# Altium project db.PrjPcb
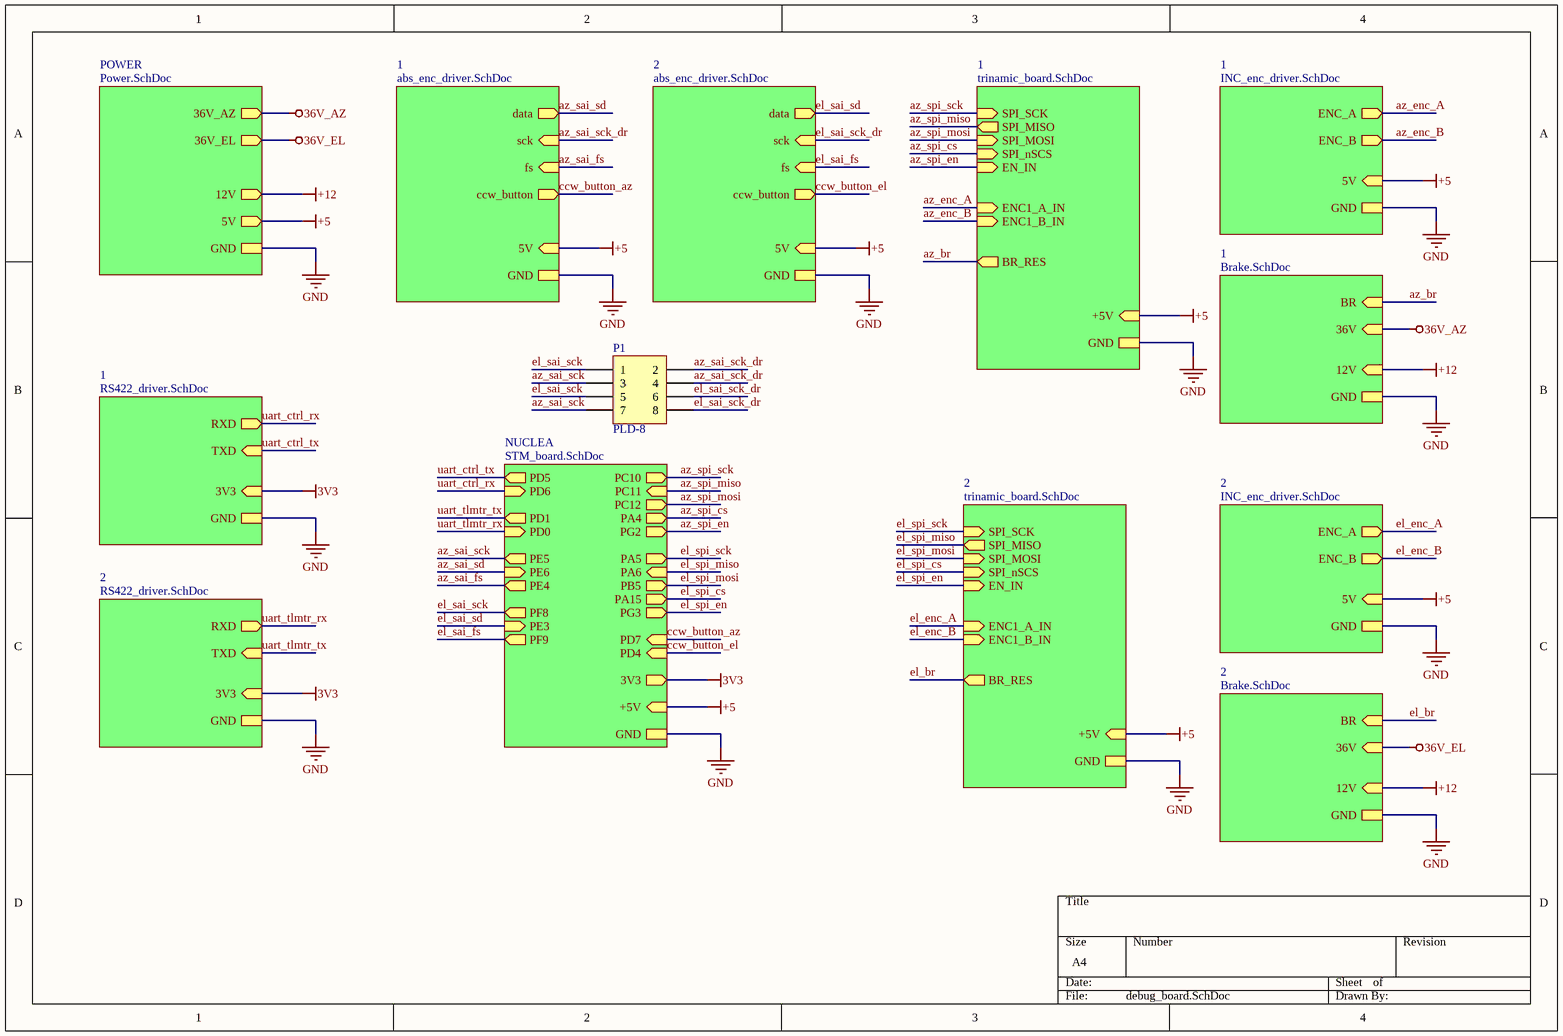
[diagram p0: debug_board.SchDoc]
8 sheets, 209 parts. Net scope: hierarchical (ports join the sheet entries above them; power ports are global).
Board file: DB.PcbDoc
Sheets:
  debug_board.SchDoc
    POWER = Power.SchDoc
    NUCLEA = STM_board.SchDoc
    1 = trinamic_board.SchDoc
    1 = abs_enc_driver.SchDoc
    1 = RS422_driver.SchDoc
    1 = INC_enc_driver.SchDoc
    1 = Brake.SchDoc
    2 = trinamic_board.SchDoc
    2 = INC_enc_driver.SchDoc
    2 = Brake.SchDoc
    2 = abs_enc_driver.SchDoc
    2 = RS422_driver.SchDoc

## Sheet debug_board.SchDoc
size A4; SheetNumber: 1; SheetTotal: 8

### Parts
P1  PLD-8  [PLD-8]

### Sub-sheets
1 = trinamic_board.SchDoc: +5V (in), GND, SPI_SCK (in), SPI_MISO (out), SPI_MOSI (in), SPI_nSCS (in), EN_IN (in), ENC1_A_IN (in), ENC1_B_IN (in), BR_RES (out)
1 = abs_enc_driver.SchDoc: fs (in), 5V (in), GND, data (out), sck (in), ccw_button (out)
1 = RS422_driver.SchDoc: 3V3 (in), GND, RXD (out), TXD (in)
1 = INC_enc_driver.SchDoc: 5V (in), GND, ENC_A (out), ENC_B (out)
1 = Brake.SchDoc: 12V (in), GND, 36V (in), BR (in)
2 = trinamic_board.SchDoc: +5V (in), GND, SPI_SCK (in), SPI_MISO (out), SPI_MOSI (in), SPI_nSCS (in), EN_IN (in), ENC1_A_IN (in), ENC1_B_IN (in), BR_RES (out)
2 = INC_enc_driver.SchDoc: 5V (in), GND, ENC_A (out), ENC_B (out)
2 = Brake.SchDoc: 12V (in), GND, 36V (in), BR (in)
2 = abs_enc_driver.SchDoc: fs (in), 5V (in), GND, data (out), sck (in), ccw_button (out)
2 = RS422_driver.SchDoc: 3V3 (in), GND, RXD (out), TXD (in)
NUCLEA = STM_board.SchDoc: PD5 (out), PD6 (in), PD0 (in), PD1 (out), PE5 (out), PE4 (out), PE6 (in), PF8 (out), PF9 (out), PE3 (in), +5V (in), GND, PC10 (out), PC11 (in), PC12 (out), PA4 (out), PG2 (out), PA5 (out), PA6 (in), PB5 (out), PA15 (out), PG3 (out), PD7 (in), PD4 (in), 3V3 (out)
POWER = Power.SchDoc: 12V (out), 5V (out), GND, 36V_EL (out), 36V_AZ (out)

### Nets
3V3: sheet NUCLEA/3V3, sheet 1/3V3, sheet 2/3V3
36V_AZ: sheet POWER/36V_AZ, sheet 1/36V
36V_EL: sheet POWER/36V_EL, sheet 2/36V
+5: sheet POWER/5V, sheet NUCLEA/+5V, sheet 1/+5V, sheet 1/5V, sheet 1/5V, sheet 2/+5V, sheet 2/5V, sheet 2/5V
+12: sheet POWER/12V, sheet 1/12V, sheet 2/12V
GND: sheet POWER/GND, sheet NUCLEA/GND, sheet 1/GND, sheet 1/GND, sheet 1/GND, sheet 1/GND, sheet 1/GND, sheet 2/GND, sheet 2/GND, sheet 2/GND, sheet 2/GND, sheet 2/GND
az_br: sheet 1/BR_RES, sheet 1/BR
az_enc_A: sheet 1/ENC1_A_IN, sheet 1/ENC_A
az_enc_B: sheet 1/ENC1_B_IN, sheet 1/ENC_B
az_sai_fs: sheet NUCLEA/PE4, sheet 1/fs
az_sai_sck: P1.3 P1.7 ; sheet NUCLEA/PE5
az_sai_sck_dr: P1.2 P1.4 ; sheet 1/sck
az_sai_sd: sheet NUCLEA/PE6, sheet 1/data
az_spi_cs: sheet NUCLEA/PA4, sheet 1/SPI_nSCS
az_spi_en: sheet NUCLEA/PG2, sheet 1/EN_IN
az_spi_miso: sheet NUCLEA/PC11, sheet 1/SPI_MISO
az_spi_mosi: sheet NUCLEA/PC12, sheet 1/SPI_MOSI
az_spi_sck: sheet NUCLEA/PC10, sheet 1/SPI_SCK
ccw_button_az: sheet NUCLEA/PD7, sheet 1/ccw_button
ccw_button_el: sheet NUCLEA/PD4, sheet 2/ccw_button
el_br: sheet 2/BR_RES, sheet 2/BR
el_enc_A: sheet 2/ENC1_A_IN, sheet 2/ENC_A
el_enc_B: sheet 2/ENC1_B_IN, sheet 2/ENC_B
el_sai_fs: sheet NUCLEA/PF9, sheet 2/fs
el_sai_sck: P1.1 P1.5 ; sheet NUCLEA/PF8
el_sai_sck_dr: P1.6 P1.8 ; sheet 2/sck
el_sai_sd: sheet NUCLEA/PE3, sheet 2/data
el_spi_cs: sheet NUCLEA/PA15, sheet 2/SPI_nSCS
el_spi_en: sheet NUCLEA/PG3, sheet 2/EN_IN
el_spi_miso: sheet NUCLEA/PA6, sheet 2/SPI_MISO
el_spi_mosi: sheet NUCLEA/PB5, sheet 2/SPI_MOSI
el_spi_sck: sheet NUCLEA/PA5, sheet 2/SPI_SCK
uart_ctrl_rx: sheet NUCLEA/PD6, sheet 1/RXD  [project net PD6]
uart_ctrl_tx: sheet NUCLEA/PD5, sheet 1/TXD  [project net PD5]
uart_tlmtr_rx: sheet NUCLEA/PD0, sheet 2/RXD  [project net PD0]
uart_tlmtr_tx: sheet NUCLEA/PD1, sheet 2/TXD  [project net PD1]

### Library data of the parts
P1 = PLD-8: Разъем штыревой на плату (папа); Производитель: Connfly electronic (Zhenqin); Номинал: 1А; Напряжение: 300В; Вид монтажа: DIP; Температурный диапазон: -55…140; Примечание: шаг 2.54 мм; Название: PLD-8; Артикул: PLD-8; Тип элемента: Разъем

## Sheet Power.SchDoc
size A4; SheetNumber: 2; SheetTotal: 8
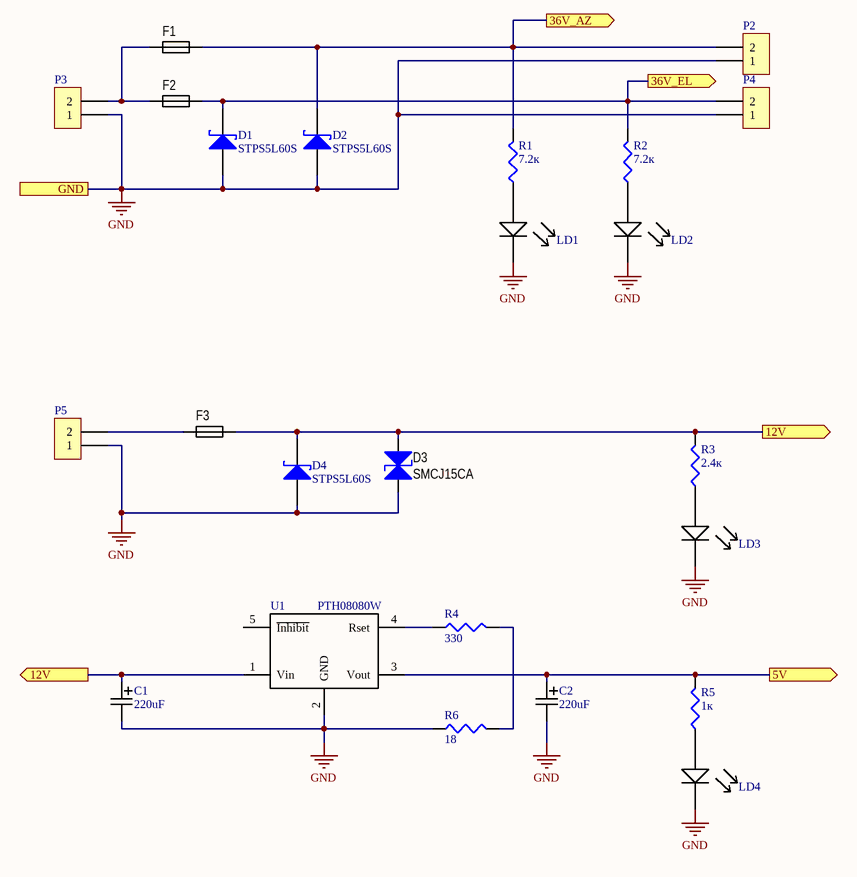
[diagram p1: Power.SchDoc]

### Parts
C1  220uF  [ECAP SMD 8x10.5]
C2  220uF  [ECAP SMD 8x10.5]
D1  STPS5L60S  [SMCJ]
D2  STPS5L60S  [SMCJ]
D3  SMCJ15CA  [SMCJ_CA]
D4  STPS5L60S  [SMCJ]
F1  FH-101C  [FH-101C]  (value not drawn)
F2  FH-101C  [FH-101C]  (value not drawn)
F3  FH-101C  [FH-101C]  (value not drawn)
LD1  GNL-3012ED  [LED 3mm]  (value not drawn)
LD2  GNL-3012ED  [LED 3mm]  (value not drawn)
LD3  GNL-3012ED  [LED 3mm]  (value not drawn)
LD4  GNL-3012ED  [LED 3mm]  (value not drawn)
P2  2EDGR-5.0-02P  [2EDGR-5.0-02P]  (value not drawn)
P3  2EDGR-5.0-02P  [2EDGR-5.0-02P]  (value not drawn)
P4  2EDGR-5.0-02P  [2EDGR-5.0-02P]  (value not drawn)
P5  15EDGRC-3.81-02  [15EDGRC-3.81-02]  (value not drawn)
R1  7.2к  [R1608-0603]
R2  7.2к  [R1608-0603]
R3  2.4к  [R1608-0603]
R4  330  [R1608-0603]
R5  1к  [R1608-0603]
R6  18  [R1608-0603]
U1  PTH08080W  [PTH08080W]

### Ports
5V (out), 12V (out), 36V_AZ (out), 36V_EL (out), GND

### Nets
36V_AZ: D2.1(K) F1.2 P2.2 R1.2 ; port 36V_AZ
36V_EL: D1.1(K) F2.2 P4.2 R2.2 ; port 36V_EL
+5: C2.1 R5.2 U1.3(Vout) ; port 5V
+12: C1.1 D3.2(A) D4.1(K) F3.2 R3.2 U1.1(Vin) ; port 12V
GND: C1.2 C2.2 D1.2(A) D2.2(A) D3.1(K) D4.2(A) LD1.1(K) LD2.1(K) LD3.1(K) LD4.1(K) P2.1 P3.1 P4.1 P5.1 R6.1 U1.2(GND) ; port GND
NetF1_1: F1.1 F2.1 P3.2
NetF3_1: F3.1 P5.2
NetLD1_2: LD1.2(A) R1.1
NetLD2_2: LD2.2(A) R2.1
NetLD3_2: LD3.2(A) R3.1
NetLD4_2: LD4.2(A) R5.1
NetR4_1: R4.1 U1.4(Rset)
NetR4_2: R4.2 R6.2

Not connected (* = marked no-connect by the designer): U1 5(~{Inhibit})

### Library data of the parts
C1 C2 = ECAP SMD: Конденсатор электролитический алюминиевый SMD 8x10.5мм; Производитель: JB Capacitors; Напряжение: 25B; Температурный диапазон: -40 ~ 105; Название: ECAP SMD; Номинал: 220uF; Диэлектрик: Электролит; Вид монтажа: SMD; Тип элемента: Конденсатор электролитический
D1 D2 D4 = STPS5L60S: Диод Шоттки 60В 5А [SMC]; Производитель: STMicroelectronics; Корпус: do-214ab/smc; Вид монтажа: SMD; Название: STPS5L60S; Артикул: STPS5L60S; Напряжение: 60В; Тип элемента: Диод шоттки
D3 = SMCJ_CА: Супрессор двунаправленный; Производитель: ST MICROELECTRONICS CO., LTD.; Корпус: DO-214AB, SMC; Номинал: 15В; Вид монтажа: SMD; Тип элемента: Защитный диод; Температурный диапазон: -55°C ~ 150°C; Название: SMCJ15CA; Артикул: SMCJ15CA; ComponentLink: http://www.digikey.com/product-detail/en/SMBJ5.0CA/SMBJ5.0CABTR-ND/2254207
F1 F2 = FH-101C: Держатель предохранителя 5x20 с крышкой; Производитель: Dragon City Industries; Номинал: 5А; Вид монтажа: DIP; Температурный диапазон: -40…85; Название: FH-101C; Артикул: FH-101C; Корпус: 5x20; Тип элемента: держатель предохранителя
F3 = FH-101C: Держатель предохранителя 5x20 с крышкой; Производитель: Dragon City Industries; Номинал: 0.75А; Вид монтажа: DIP; Температурный диапазон: -40…85; Название: FH-101C; Артикул: FH-101C; Корпус: 5x20; Тип элемента: держатель предохранителя
LD1-LD4 = GNL-3012ED: Светодиод красный 3мм; Производитель: STMicroelectronics; Вид монтажа: DIP; Название: GNL-3012ED; Артикул: GNL-3012ED; Тип элемента: Светодиод
P2-P4 = 2EDGR-5.0-02P: Разъем штыревой на плату (папа); Производитель: Degson; Номинал: 10А; Напряжение: 300В; Вид монтажа: DIP; Температурный диапазон: -40℃~105℃; Примечание: шаг 5 мм; Название: 2EDGR-5.0-02P; Артикул: 2EDGR-5.0-02P; Тип элемента: Разъем
P5 = 15EDGRC-3.81-02: Разъем штыревой на плату (папа); Производитель: Degson; Номинал: 8А; Напряжение: 300В; Вид монтажа: DIP; Температурный диапазон: -40℃~105℃; Примечание: шаг 3.81 мм; Название: 15EDGRC-3.81-02; Артикул: 15EDGRC-3.81-02; Тип элемента: Разъем
R1-R6 = resistor: SMD резистор; Производитель: 1%; Корпус: 0603 (1608 Metric); Точность: 1%; Название: Резистор; Вид монтажа: SMD; Тип элемента: Резистор
  R1 R2: Номинал: 7.2к
  R3: Номинал: 2.4к
  R4: Номинал: 330
  R5: Номинал: 1к
  R6: Номинал: 18
U1 = PTH08080W: DC/DC преобразователь; Производитель: Texas Instruments; Номинал: 2.25А; Напряжение: 18/0.9-5.5В; Вид монтажа: DIP; Тип элемента: Модуль питания; Температурный диапазон: -40°C ~ 85°C; Название: PTH08080W; ComponentLink: http://www.digikey.com/product-detail/en/AD22100STZ/AD22100STZ-ND/936657; Артикул: PTH08080W

## Sheet STM_board.SchDoc
size A4; SheetNumber: 7; SheetTotal: 8
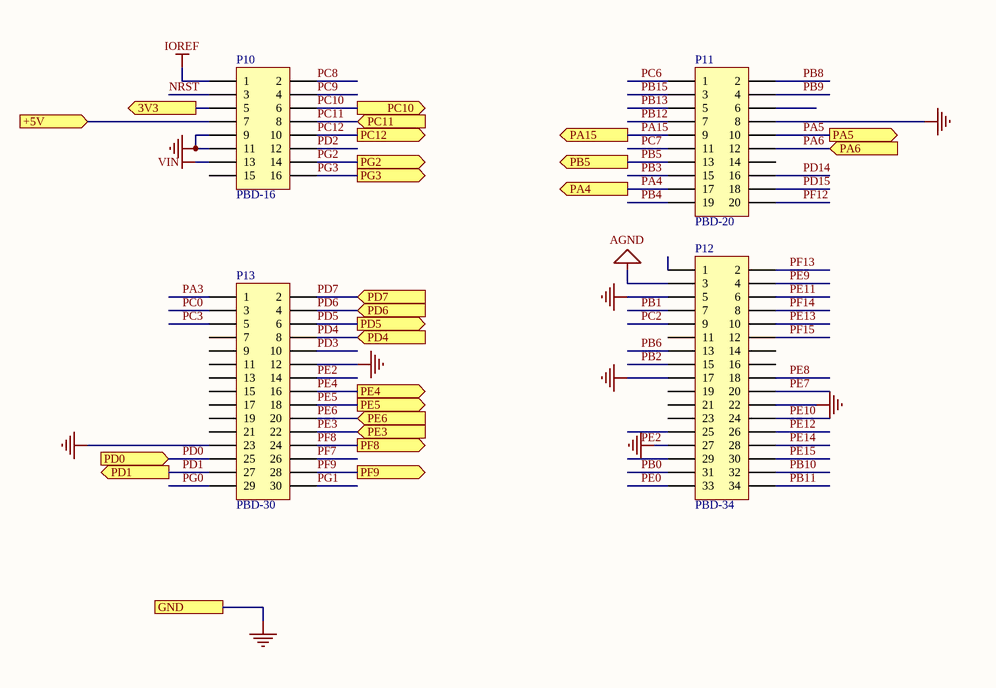
[diagram p2: STM_board.SchDoc]

### Parts
P10  PBD-16  [PBD-16]
P11  PBD-20  [PBD-20]
P12  PBD-34  [PBD-34]
P13  PBD-30  [PBD-30]

### Ports
3V3 (out), +5V (in), GND, PA4 (out), PA5 (out), PA6 (in), PA15 (out), PB5 (out), PC10 (out), PC11 (in), PC12 (out), PD0 (in), PD1 (out), PD4 (in), PD5 (out), PD6 (in), PD7 (in), PE3 (in), PE4 (out), PE5 (out), PE6 (in), PF8 (out), PF9 (out), PG2 (out), PG3 (out)

### Nets
3V3: P10.5 ; port 3V3
+5: P10.7 ; port +5V
AGND: P12.3
GND: P10.9 P10.11 P11.8 P12.5 P12.17 P12.22 P12.27 P13.12 P13.23 ; port GND
IOREF: P10.1
VIN: P10.13
NRST: P10.3
PA3: P13.1
PA4: P11.17 ; port PA4  [project net az_spi_cs]
PA5: P11.10 ; port PA5  [project net el_spi_sck]
PA6: P11.12 ; port PA6  [project net el_spi_miso]
PA15: P11.9 ; port PA15  [project net el_spi_cs]
PB0: P12.31
PB1: P12.7
PB2: P12.15
PB3: P11.15
PB4: P11.19
PB5: P11.13 ; port PB5  [project net el_spi_mosi]
PB6: P12.13
PB8: P11.2
PB9: P11.4
PB10: P12.32
PB11: P12.34
PB12: P11.7
PB13: P11.5
PB15: P11.3
PC0: P13.3
PC2: P12.9
PC3: P13.5
PC6: P11.1
PC7: P11.11
PC8: P10.2
PC9: P10.4
PC10: P10.6 ; port PC10  [project net az_spi_sck]
PC11: P10.8 ; port PC11  [project net az_spi_miso]
PC12: P10.10 ; port PC12  [project net az_spi_mosi]
PD0: P13.25 ; port PD0
PD1: P13.27 ; port PD1
PD2: P10.12
PD3: P13.10
PD4: P13.8 ; port PD4  [project net ccw_button_el]
PD5: P13.6 ; port PD5
PD6: P13.4 ; port PD6
PD7: P13.2 ; port PD7  [project net ccw_button_az]
PD14: P11.16
PD15: P11.18
PE0: P12.33
PE2: P13.14
PE3: P13.22 ; port PE3  [project net el_sai_sd]
PE4: P13.16 ; port PE4  [project net az_sai_fs]
PE5: P13.18 ; port PE5  [project net az_sai_sck]
PE6: P13.20 ; port PE6  [project net az_sai_sd]
PE7: P12.20
PE8: P12.18
PE9: P12.4
PE10: P12.24
PE11: P12.6
PE12: P12.26
PE13: P12.10
PE14: P12.28
PE15: P12.30
PF7: P13.26
PF8: P13.24 ; port PF8  [project net el_sai_sck]
PF9: P13.28 ; port PF9  [project net el_sai_fs]
PF12: P11.20
PF13: P12.2
PF14: P12.8
PF15: P12.12
PG0: P13.29
PG1: P13.30
PG2: P10.14 ; port PG2  [project net az_spi_en]
PG3: P10.16 ; port PG3  [project net el_spi_en]

Not connected (* = marked no-connect by the designer): P10 15; P11 6 14; P12 1 11 14 16 19 21 23 25 29; P13 7 9 11 13 15 17 19 21

### Notes on the sheet
- Labels drawn without touching a wire or pin: PE2

### Library data of the parts
P10 = PBD-16: Гнездо на плату; Производитель: Connfly electronic (Zhenqin); Номинал: 1А; Напряжение: 300В; Вид монтажа: DIP; Тип элемента: Разъем; Температурный диапазон: -55…140; Примечание: шаг 2.54 мм; Название: PBD-16; Артикул: PBD-16
P11 = PBD-20: Гнездо на плату; Производитель: Connfly electronic (Zhenqin); Номинал: 1А; Напряжение: 300В; Вид монтажа: DIP; Тип элемента: Разъем; Температурный диапазон: -55…140; Примечание: шаг 2.54 мм; Название: PBD-20; Артикул: PBD-20
P12 = PBD-34: Гнездо на плату; Производитель: Connfly electronic (Zhenqin); Номинал: 1А; Напряжение: 300В; Вид монтажа: DIP; Тип элемента: Разъем; Температурный диапазон: -55…140; Примечание: шаг 2.54 мм; Название: PBD-34; Артикул: PBD-34
P13 = PBD-30: Гнездо на плату; Производитель: Connfly electronic (Zhenqin); Номинал: 1А; Напряжение: 300В; Вид монтажа: DIP; Тип элемента: Разъем; Температурный диапазон: -55…140; Примечание: шаг 2.54 мм; Название: PBD-30; Артикул: PBD-30

## Sheet trinamic_board.SchDoc
size A4; SheetNumber: 8; SheetTotal: 8
Used 2 times, as channels 1, 2. Parts and nets are listed once, with the designators drawn on the sheet.
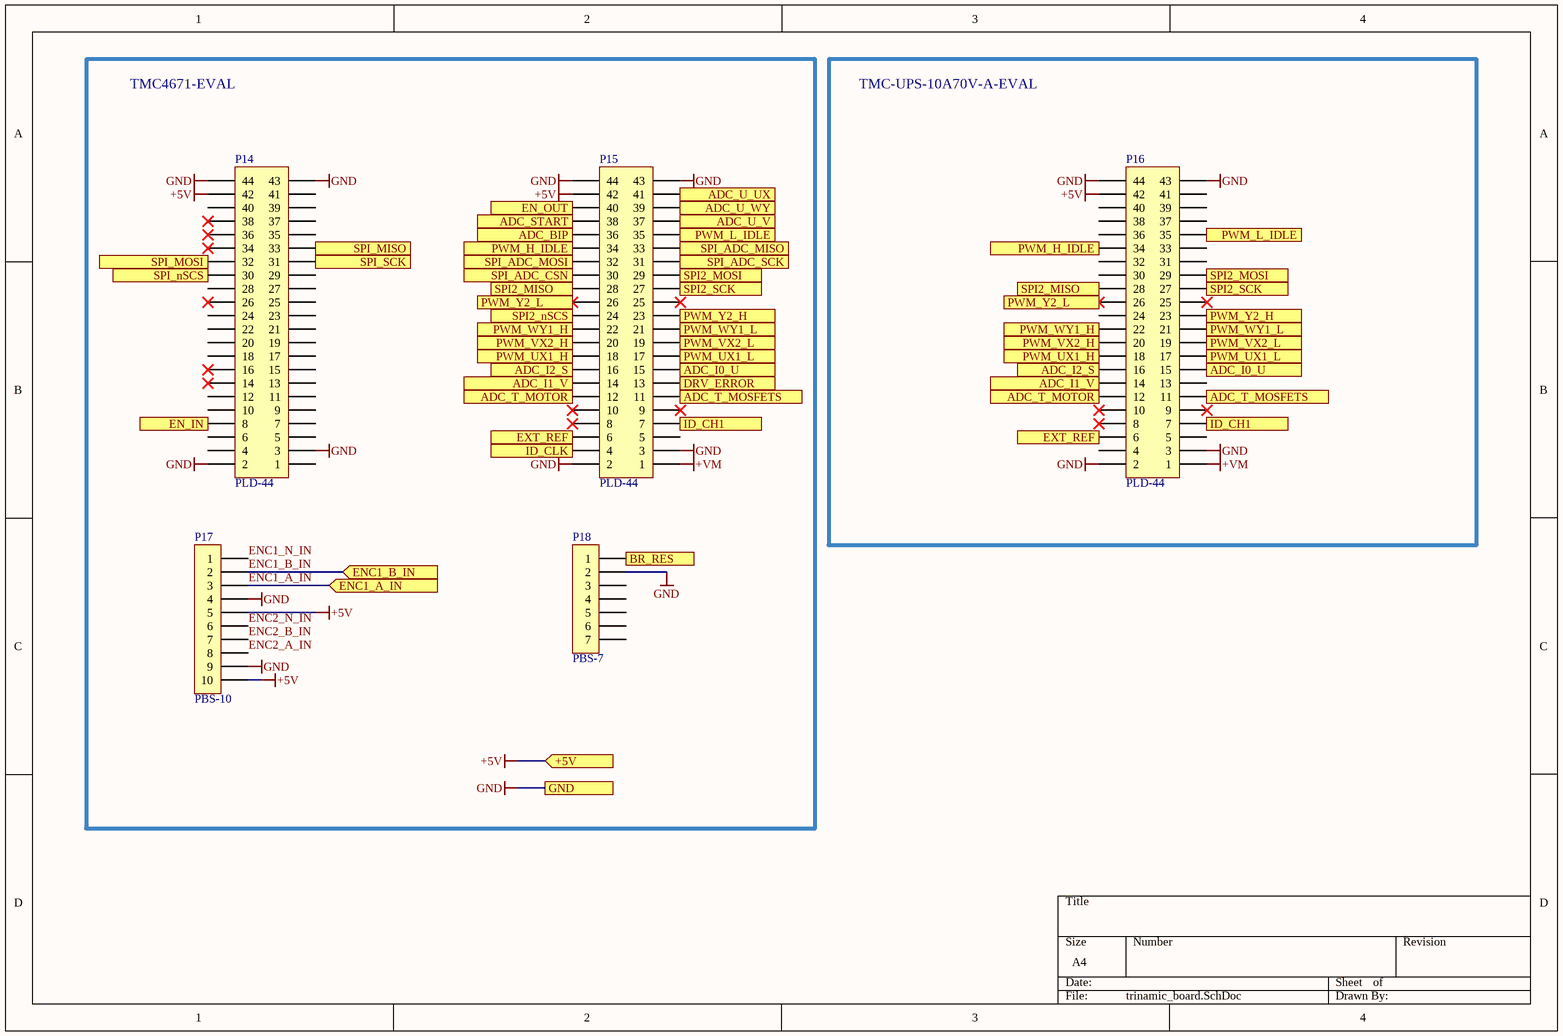
[diagram p3: trinamic_board.SchDoc]

### Parts
P14  PLD-44  [PLD-44]
P15  PLD-44  [PLD-44]
P16  PLD-44  [PLD-44]
P17  PBS-10  [PBS-10]
P18  PBS-7  [PBS-7]

### Blocks framed on the sheet
TMC4671-EVAL: P14 P15 P17 P18
TMC-UPS-10A70V-A-EVAL: P16

### Ports
+5V (in), ADC_BIP, ADC_I0_U, ADC_I1_V, ADC_I2_S, ADC_START, ADC_T_MOSFETS, ADC_T_MOTOR, ADC_U_UX, ADC_U_V, ADC_U_WY, BR_RES (out), DRV_ERROR, EN_IN (in), EN_OUT, ENC1_A_IN (in), ENC1_B_IN (in), EXT_REF, GND, ID_CH1, ID_CLK, PWM_H_IDLE, PWM_L_IDLE, PWM_UX1_H, PWM_UX1_L, PWM_VX2_H, PWM_VX2_L, PWM_WY1_H, PWM_WY1_L, PWM_Y2_H, PWM_Y2_L, SPI2_MISO, SPI2_MOSI, SPI2_nSCS, SPI2_SCK, SPI_ADC_CSN, SPI_ADC_MISO, SPI_ADC_MOSI, SPI_ADC_SCK, SPI_MISO (out), SPI_MOSI (in), SPI_nSCS (in), SPI_SCK (in)

### Nets
+5V: P14.42 P15.42 P16.42 P17.5 P17.10 ; port +5V
+VM: P15.1 P16.1
GND: P14.2 P14.3 P14.43 P14.44 P15.2 P15.3 P15.43 P15.44 P16.2 P16.3 P16.43 P16.44 P17.4 P17.9 P18.2 ; port GND
ADC_BIP: P15.36 ; port ADC_BIP
ADC_I0_U: P15.15 P16.15 ; port ADC_I0_U
ADC_I1_V: P15.14 P16.14 ; port ADC_I1_V
ADC_I2_S: P15.16 P16.16 ; port ADC_I2_S
ADC_START: P15.38 ; port ADC_START
ADC_T_MOSFETS: P15.11 P16.11 ; port ADC_T_MOSFETS
ADC_T_MOTOR: P15.12 P16.12 ; port ADC_T_MOTOR
ADC_U_UX: P15.41 ; port ADC_U_UX
ADC_U_V: P15.37 ; port ADC_U_V
ADC_U_WY: P15.39 ; port ADC_U_WY
BR_RES: P18.1 ; port BR_RES
DRV_ERROR: P15.13 ; port DRV_ERROR
EN_IN: P14.8 ; port EN_IN
EN_OUT: P15.40 ; port EN_OUT
ENC1_A_IN: P17.3 ; port ENC1_A_IN
ENC1_B_IN: P17.2 ; port ENC1_B_IN
ENC1_N_IN: P17.1
ENC2_A_IN: P17.8
ENC2_B_IN: P17.7
ENC2_N_IN: P17.6
EXT_REF: P15.6 P16.6 ; port EXT_REF
ID_CH1: P15.7 P16.7 ; port ID_CH1
ID_CLK: P15.4 ; port ID_CLK
PWM_H_IDLE: P15.34 P16.34 ; port PWM_H_IDLE
PWM_L_IDLE: P15.35 P16.35 ; port PWM_L_IDLE
PWM_UX1_H: P15.18 P16.18 ; port PWM_UX1_H
PWM_UX1_L: P15.17 P16.17 ; port PWM_UX1_L
PWM_VX2_H: P15.20 P16.20 ; port PWM_VX2_H
PWM_VX2_L: P15.19 P16.19 ; port PWM_VX2_L
PWM_WY1_H: P15.22 P16.22 ; port PWM_WY1_H
PWM_WY1_L: P15.21 P16.21 ; port PWM_WY1_L
PWM_Y2_H: P15.23 P16.23 ; port PWM_Y2_H
PWM_Y2_L: P15.26 P16.26 ; port PWM_Y2_L
SPI2_MISO: P15.28 P16.28 ; port SPI2_MISO
SPI2_MOSI: P15.29 P16.29 ; port SPI2_MOSI
SPI2_nSCS: P15.24 ; port SPI2_nSCS
SPI2_SCK: P15.27 P16.27 ; port SPI2_SCK
SPI_ADC_CSN: P15.30 ; port SPI_ADC_CSN
SPI_ADC_MISO: P15.33 ; port SPI_ADC_MISO
SPI_ADC_MOSI: P15.32 ; port SPI_ADC_MOSI
SPI_ADC_SCK: P15.31 ; port SPI_ADC_SCK
SPI_MISO: P14.33 ; port SPI_MISO
SPI_MOSI: P14.32 ; port SPI_MOSI
SPI_nSCS: P14.30 ; port SPI_nSCS
SPI_SCK: P14.31 ; port SPI_SCK

Not connected (* = marked no-connect by the designer): P14 1 4 5 6 7 9 10 11 12 13 14* 15 16* 17 18 19 20 21 22 23 24 25 26* 27 28 29 34* 35 36* 37 38* 39 40 41; P15 5 8* 9* 10* 25*; P16 4 5 8* 9* 10* 13 24 25* 30 31 32 33 36 37 38 39 40 41; P18 3 4 5 6 7

### Channels
1: designators end in _1; ports +5V=+5 ADC_BIP=NetP15_1_36 ADC_I0_U=NetP15_1_15 ADC_I1_V=NetP15_1_14 ADC_I2_S=NetP15_1_16 ADC_START=NetP15_1_38 ADC_T_MOSFETS=NetP15_1_11 ADC_T_MOTOR=NetP15_1_12 ADC_U_UX=NetP15_1_41 ADC_U_V=NetP15_1_37 ADC_U_WY=NetP15_1_39 BR_RES=az_br DRV_ERROR=NetP15_1_13 EN_IN=az_spi_en EN_OUT=NetP15_1_40 ENC1_A_IN=az_enc_A ENC1_B_IN=az_enc_B EXT_REF=NetP15_1_6 GND=GND ID_CH1=NetP15_1_7 ID_CLK=NetP15_1_4 PWM_H_IDLE=NetP15_1_34 PWM_L_IDLE=NetP15_1_35 PWM_UX1_H=NetP15_1_18 PWM_UX1_L=NetP15_1_17 PWM_VX2_H=NetP15_1_20 PWM_VX2_L=NetP15_1_19 PWM_WY1_H=NetP15_1_22 PWM_WY1_L=NetP15_1_21 PWM_Y2_H=NetP15_1_23 PWM_Y2_L=NetP15_1_26 SPI2_MISO=NetP15_1_28 SPI2_MOSI=NetP15_1_29 SPI2_nSCS=NetP15_1_24 SPI2_SCK=NetP15_1_27 SPI_ADC_CSN=NetP15_1_30 SPI_ADC_MISO=NetP15_1_33 SPI_ADC_MOSI=NetP15_1_32 SPI_ADC_SCK=NetP15_1_31 SPI_MISO=az_spi_miso SPI_MOSI=az_spi_mosi SPI_nSCS=az_spi_cs SPI_SCK=az_spi_sck
2: designators end in _2; ports +5V=+5 ADC_BIP=NetP15_2_36 ADC_I0_U=NetP15_2_15 ADC_I1_V=NetP15_2_14 ADC_I2_S=NetP15_2_16 ADC_START=NetP15_2_38 ADC_T_MOSFETS=NetP15_2_11 ADC_T_MOTOR=NetP15_2_12 ADC_U_UX=NetP15_2_41 ADC_U_V=NetP15_2_37 ADC_U_WY=NetP15_2_39 BR_RES=el_br DRV_ERROR=NetP15_2_13 EN_IN=el_spi_en EN_OUT=NetP15_2_40 ENC1_A_IN=el_enc_A ENC1_B_IN=el_enc_B EXT_REF=NetP15_2_6 GND=GND ID_CH1=NetP15_2_7 ID_CLK=NetP15_2_4 PWM_H_IDLE=NetP15_2_34 PWM_L_IDLE=NetP15_2_35 PWM_UX1_H=NetP15_2_18 PWM_UX1_L=NetP15_2_17 PWM_VX2_H=NetP15_2_20 PWM_VX2_L=NetP15_2_19 PWM_WY1_H=NetP15_2_22 PWM_WY1_L=NetP15_2_21 PWM_Y2_H=NetP15_2_23 PWM_Y2_L=NetP15_2_26 SPI2_MISO=NetP15_2_28 SPI2_MOSI=NetP15_2_29 SPI2_nSCS=NetP15_2_24 SPI2_SCK=NetP15_2_27 SPI_ADC_CSN=NetP15_2_30 SPI_ADC_MISO=NetP15_2_33 SPI_ADC_MOSI=NetP15_2_32 SPI_ADC_SCK=NetP15_2_31 SPI_MISO=el_spi_miso SPI_MOSI=el_spi_mosi SPI_nSCS=el_spi_cs SPI_SCK=el_spi_sck

### Library data of the parts
P14-P16 = PLD-44: Разъем штыревой на плату (папа); Производитель: Connfly electronic (Zhenqin); Номинал: 1А; Напряжение: 300В; Вид монтажа: DIP; Температурный диапазон: -55…140; Примечание: шаг 2.54 мм; Название: PLD-44; Артикул: PLD-44; Тип элемента: Разъем
P17 = PBS-10: Гнездо на плату; Производитель: Connfly electronic (Zhenqin); Номинал: 1А; Напряжение: 300В; Вид монтажа: DIP; Тип элемента: Разъем; Температурный диапазон: -55…140; Примечание: шаг 2.54 мм; Название: PBS-10; Артикул: PBS-10
P18 = PBS-7: Гнездо на плату; Производитель: Connfly electronic (Zhenqin); Номинал: 1А; Напряжение: 300В; Вид монтажа: DIP; Тип элемента: Разъем; Температурный диапазон: -55…140; Примечание: шаг 2.54 мм; Название: PBS-7; Артикул: PBS-7

## Sheet abs_enc_driver.SchDoc
size A4; SheetNumber: 3; SheetTotal: 8
Used 2 times, as channels 1, 2. Parts and nets are listed once, with the designators drawn on the sheet.
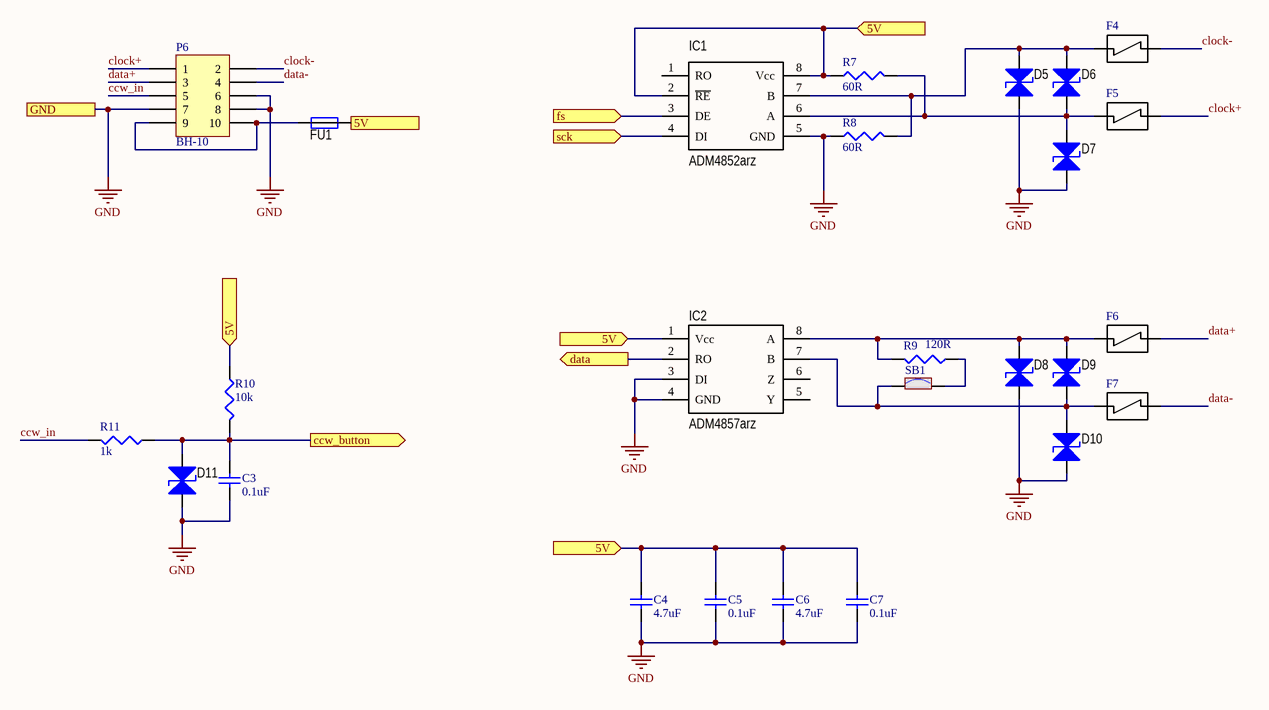
[diagram p4: abs_enc_driver.SchDoc]

### Parts
C3  0.1uF  [C1608-0603]
C4  4.7uF  [C1608-0603]
C5  0.1uF  [C1608-0603]
C6  4.7uF  [C1608-0603]
C7  0.1uF  [C1608-0603]
D5  SMBJ5.0CA  [SMB_H]  (value not drawn)
D6  SMBJ5.0CA  [SMB_H]  (value not drawn)
D7  SMBJ5.0CA  [SMB_H]  (value not drawn)
D8  SMBJ5.0CA  [SMB_H]  (value not drawn)
D9  SMBJ5.0CA  [SMB_H]  (value not drawn)
D10  SMBJ5.0CA  [SMB_H]  (value not drawn)
D11  SMBJ5.0CA  [SMB_H]  (value not drawn)
F4  TBU-CA065-200-WH  [TBU_CA]  (value not drawn)
F5  TBU-CA065-200-WH  [TBU_CA]  (value not drawn)
F6  TBU-CA065-200-WH  [TBU_CA]  (value not drawn)
F7  TBU-CA065-200-WH  [TBU_CA]  (value not drawn)
FU1  MF-MSMF030  [MF-MSMF]  (value not drawn)
IC1  ADM4852arz  [SO8_N]
IC2  ADM4857arz  [SO8_N]
P6  BH-10  [BH-10]
R7  60R  [R1608-0603]
R8  60R  [R1608-0603]
R9  120R  [R1608-0603]
R10  10k  [R1608-0603]
R11  1k  [R1608-0603]
SB1  (no value)  [SOLDER-BRIDGE_R0603-0R]  (no BOM)

### Ports
5V (in), ccw_button (out), data (out), fs (in), GND, sck (in)

### Nets
GND: C3.1 C4.1 C5.1 C6.1 C7.1 D5.1(K) D7.1(K) D8.1(K) D10.1(K) D11.1(K) IC1.5(GND) IC2.3(DI) IC2.4(GND) P6.6 P6.7 P6.8 R8.1 ; port GND
5V: C4.2 C5.2 C6.2 C7.2 FU1.2 IC1.2(~{RE}) IC1.8(Vcc) IC2.1(Vcc) R7.1 R10.1 ; port 5V
ccw_button: C3.2 D11.2(A) R10.2 R11.1 ; port ccw_button
ccw_in: P6.5 R11.2
clock+: F5.1 P6.1
clock-: F4.1 P6.2
data: IC2.2(RO) ; port data
data+: F6.1 P6.3
data-: F7.1 P6.4
fs: IC1.3(DE) ; port fs
sck: IC1.4(DI) ; port sck
NetD5_2: D5.2(A) D6.2(A) F4.0 IC1.7(B) R8.2
NetD6_1: D6.1(K) D7.2(A) F5.0 IC1.6(A) R7.2
NetD8_2: D8.2(A) D9.2(A) F6.0 IC2.8(A) R9.2
NetD9_1: D9.1(K) D10.2(A) F7.0 IC2.7(B) SB1.1
NetFU1_1: FU1.1 P6.9 P6.10
NetR9_1: R9.1 SB1.2

Not connected (* = marked no-connect by the designer): IC1 1(RO); IC2 5(Y) 6(Z)

### Channels
1: designators end in _1; ports 5V=+5 ccw_button=ccw_button_az data=az_sai_sd fs=az_sai_fs GND=GND sck=az_sai_sck_dr
2: designators end in _2; ports 5V=+5 ccw_button=ccw_button_el data=el_sai_sd fs=el_sai_fs GND=GND sck=el_sai_sck_dr

### Library data of the parts
C3-C7 = Cap: Керамическийконденсатор; Корпус: 0603 (1608 Metric); Диэлектрик: X5R; Напряжение: 16B; Вид монтажа: SMD; Температурный диапазон: -55 ~ 100; Тип элемента: Керамический конденсатор
  C3 C5 C7: Номинал: 0.1uF
  C4 C6: Номинал: 4.7uF
D5-D11 = SMBJ_CА: Супрессор двунаправленный; Производитель: ST MICROELECTRONICS CO., LTD.; Корпус: DO-214AA, SMB; Номинал: 5В; Вид монтажа: SMD; Тип элемента: Защитный диод; Температурный диапазон: -55°C ~ 150°C; Название: SMBJ5.0CA; Артикул: SMBJ5.0CA; ComponentLink: http://www.digikey.com/product-detail/en/SMBJ5.0CA/SMBJ5.0CABTR-ND/2254207
F4-F7 = TBU-CA: Самовосстанавливающийся предохранитель; Производитель: Bourns; Корпус: DFN; Номинал: 0.4A; Вид монтажа: SMD; Температурный диапазон: -40 to +125 °C; Название: TBU-CA065-200-WH; Артикул: TBU-CA065-200-WH; Тип элемента: Самовосстанавливающийся предохранитель
FU1 = MF-MSMF030: PTC Resettable Fuses; Производитель: Bourns; Корпус: 1812; Номинал: 0.3А; Вид монтажа: SMD; Тип элемента: Самовосстанавливающийся предохранитель; Температурный диапазон: -40…85; Напряжение: 13.2В; Название: MF-MSMF030; Артикул: MF-MSMF030
IC1 = ADM4852: RS-485 Трансивер; Производитель: Analog Devices; Корпус: SOIC8; Вид монтажа: SMD; Тип элемента: Драйвер интерфейса RS-485; Температурный диапазон: -40°C ~ 85°C; Артикул: ADM4852arz; Название: ADM4852arz
IC2 = ADM4857: RS-485 Трансивер; Производитель: Analog Devices; Корпус: SOIC8; Вид монтажа: SMD; Тип элемента: Драйвер интерфейса RS-485; Температурный диапазон: -40°C ~ 85°C; Артикул: ADM4857arz; Название: ADM4857arz
P6 = BH-10: Разъем штыревой на плату; Производитель: Connfly electronic (Zhenqin); Номинал: 1А; Напряжение: 300В; Вид монтажа: DIP; Температурный диапазон: -55…140; Примечание: шаг 2.54 мм; Название: BH-10; Артикул: BH-10; Тип элемента: Разъем
R7-R11 = resistor: as R1 on sheet Power; Точность: 1%; Название: Резистор; Вид монтажа: SMD; Тип элемента: Резистор
  R7 R8: Номинал: 60R
  R9: Номинал: 120R
  R10: Номинал: 10k
  R11: Номинал: 1k
SB1 = SB: Перемычка

## Sheet RS422_driver.SchDoc
size A4; SheetNumber: 4; SheetTotal: 8
Used 2 times, as channels 1, 2. Parts and nets are listed once, with the designators drawn on the sheet.
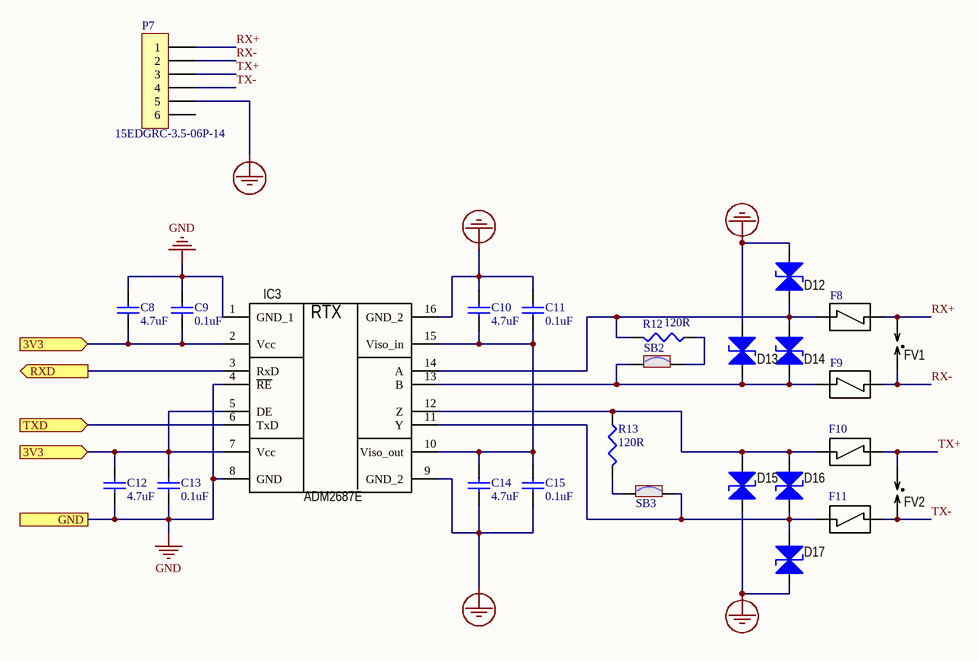
[diagram p5: RS422_driver.SchDoc]

### Parts
C8  4.7uF  [C1608-0603]
C9  0.1uF  [C1608-0603]
C10  4.7uF  [C1608-0603]
C11  0.1uF  [C1608-0603]
C12  4.7uF  [C1608-0603]
C13  0.1uF  [C1608-0603]
C14  4.7uF  [C1608-0603]
C15  0.1uF  [C1608-0603]
D12  SMBJ5.0CA  [SMB_H]  (value not drawn)
D13  SMBJ5.0CA  [SMB_H]  (value not drawn)
D14  SMBJ5.0CA  [SMB_H]  (value not drawn)
D15  SMBJ5.0CA  [SMB_H]  (value not drawn)
D16  SMBJ5.0CA  [SMB_H]  (value not drawn)
D17  SMBJ5.0CA  [SMB_H]  (value not drawn)
F8  TBU-CA065-200-WH  [TBU_CA]  (value not drawn)
F9  TBU-CA065-200-WH  [TBU_CA]  (value not drawn)
F10  TBU-CA065-200-WH  [TBU_CA]  (value not drawn)
F11  TBU-CA065-200-WH  [TBU_CA]  (value not drawn)
FV1  NS2R-75A1-M  [NS2R-xxx-x]  (value not drawn)
FV2  NS2R-75A1-M  [NS2R-xxx-x]  (value not drawn)
IC3  ADM2687E  [SO16_WIDE(300mil)_13x10_H]
P7  15EDGRC-3.5-06P-14  [15EDGRC-3.5-06P-14]
R12  120R  [R1608-0603]
R13  120R  [R1608-0603]
SB2  (no value)  [SOLDER-BRIDGE_R0603-0R]  (no BOM)
SB3  (no value)  [SOLDER-BRIDGE_R0603-0R]  (no BOM)

### Ports
3V3 (in), GND, RXD (out), TXD (in)

### Nets
GND: C8.2 C9.2 C12.1 C13.1 IC3.1(GND_1) IC3.4(~{RE}) IC3.8(GND) ; port GND
GND_line: C10.2 C11.2 C14.1 C15.1 D12.1(K) D13.1(K) D15.1(K) D17.1(K) IC3.9(GND_2) IC3.16(GND_2) P7.5
3V3: C8.1 C9.1 C12.2 C13.2 IC3.2(Vcc) IC3.5(DE) IC3.7(Vcc) ; port 3V3
RX+: F8.1 FV1.2(L) P7.1
RX-: F9.1 FV1.1(R) P7.2
RXD: IC3.3(RxD) ; port RXD
TX+: F10.1 FV2.1(R) P7.3
TX-: F11.1 FV2.2(L) P7.4
TXD: IC3.6(TxD) ; port TXD
NetC10_1: C10.1 C11.1 C14.2 C15.2 IC3.10(Viso_out) IC3.15(Viso_in)
NetD12_2: D12.2(A) D14.1(K) F8.0 IC3.14(A) R12.2
NetD13_2: D13.2(A) D14.2(A) F9.0 IC3.13(B) SB2.1
NetD15_2: D15.2(A) D16.2(A) F10.0 IC3.12(Z) R13.2
NetD16_1: D16.1(K) D17.2(A) F11.0 IC3.11(Y) SB3.1
NetR12_1: R12.1 SB2.2
NetR13_1: R13.1 SB3.2

Not connected (* = marked no-connect by the designer): P7 6

### Channels
1: designators end in _1; ports 3V3=3V3 GND=GND RXD=PD6 TXD=PD5
2: designators end in _2; ports 3V3=3V3 GND=GND RXD=PD0 TXD=PD1

### Notes on the sheet
- (in symbol ADM2687E) RTX

### Library data of the parts
C8-C15 = Cap: as C3 on sheet abs_enc_driver; Тип элемента: Керамический конденсатор
  C8 C10 C12 C14: Номинал: 4.7uF
  C9 C11 C13 C15: Номинал: 0.1uF
D12-D17 = SMBJ_CА: as D5 on sheet abs_enc_driver; Название: SMBJ5.0CA; Артикул: SMBJ5.0CA; ComponentLink: http://www.digikey.com/product-detail/en/SMBJ5.0CA/SMBJ5.0CABTR-ND/2254207
F8-F11 = TBU-CA: as F4 on sheet abs_enc_driver; Название: TBU-CA065-200-WH; Артикул: TBU-CA065-200-WH; Тип элемента: Самовосстанавливающийся предохранитель
FV1 FV2 = NS2R-xxx-x_1: Газовый разрядник двухэлектродный; Номинал: 75В; Название: NS2R-75A1-M; Артикул: NS2R-75A1-M; Напряжение: 75В; Тип элемента: разрядник двухэлектродный
IC3 = ADM2687E: RS-485 Трансивер изолированный; Производитель: Analog Devices; Корпус: SOIC16; Вид монтажа: SMD; Тип элемента: Драйвер интерфейса RS-485, RS-422; Температурный диапазон: -40°C ~ 85°C; Артикул: ADM2687E; Название: ADM2687E
P7 = 15EDGRC-3.5-06P-14: Разъем штыревой на плату (папа); Производитель: Degson; Номинал: 8А; Напряжение: 300В; Вид монтажа: DIP; Температурный диапазон: -40℃~105℃; Примечание: шаг 3.5 мм; Название: 15EDGRC-3.5-06P-14; Артикул: 15EDGRC-3.5-06P-14; Тип элемента: Разъем
R12 R13 = resistor: as R1 on sheet Power; Номинал: 120R; Точность: 1%; Название: Резистор; Вид монтажа: SMD; Тип элемента: Резистор
SB2 SB3 = SB: Перемычка

## Sheet INC_enc_driver.SchDoc
size A4; SheetNumber: 5; SheetTotal: 8
Used 2 times, as channels 1, 2. Parts and nets are listed once, with the designators drawn on the sheet.
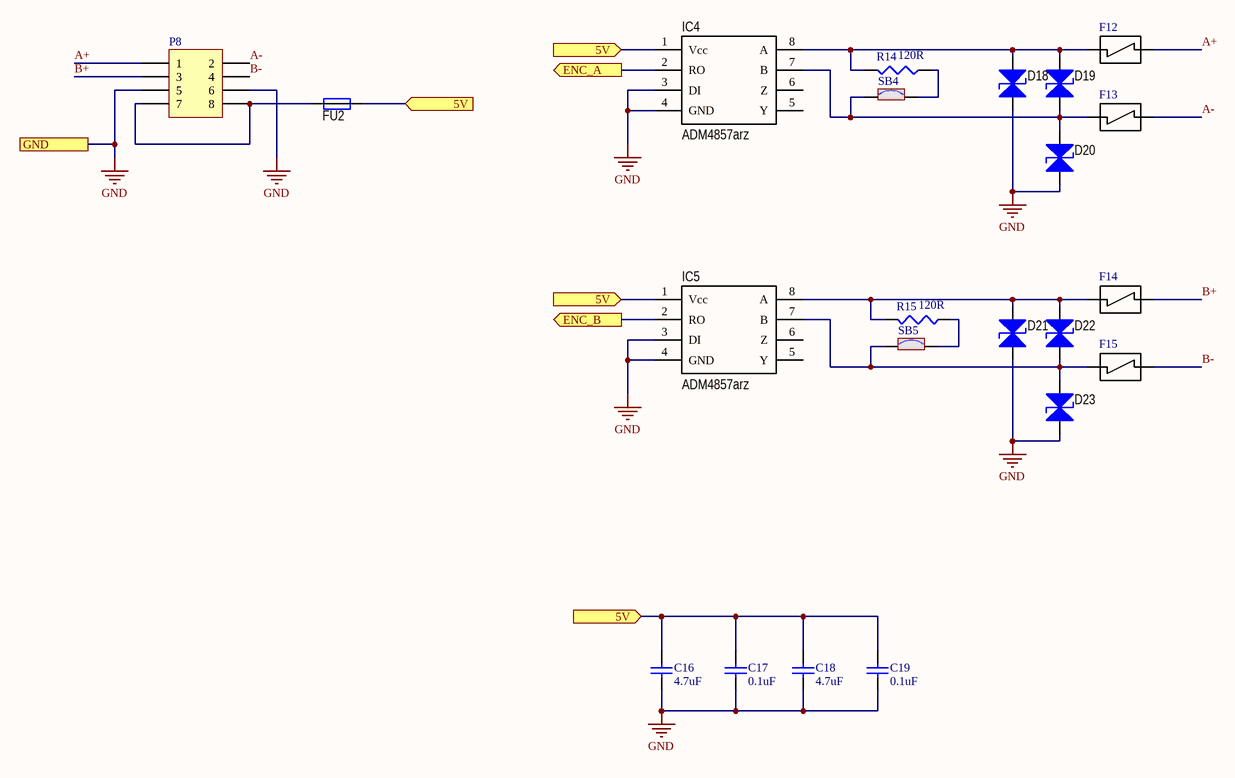
[diagram p6: INC_enc_driver.SchDoc]

### Parts
C16  4.7uF  [C1608-0603]
C17  0.1uF  [C1608-0603]
C18  4.7uF  [C1608-0603]
C19  0.1uF  [C1608-0603]
D18  SMBJ5.0CA  [SMB_H]  (value not drawn)
D19  SMBJ5.0CA  [SMB_H]  (value not drawn)
D20  SMBJ5.0CA  [SMB_H]  (value not drawn)
D21  SMBJ5.0CA  [SMB_H]  (value not drawn)
D22  SMBJ5.0CA  [SMB_H]  (value not drawn)
D23  SMBJ5.0CA  [SMB_H]  (value not drawn)
F12  TBU-CA065-200-WH  [TBU_CA]  (value not drawn)
F13  TBU-CA065-200-WH  [TBU_CA]  (value not drawn)
F14  TBU-CA065-200-WH  [TBU_CA]  (value not drawn)
F15  TBU-CA065-200-WH  [TBU_CA]  (value not drawn)
FU2  MF-MSMF030  [MF-MSMF]  (value not drawn)
IC4  ADM4857arz  [SO8_N]
IC5  ADM4857arz  [SO8_N]
P8  BH-08  [BH-08]  (value not drawn)
R14  120R  [R1608-0603]
R15  120R  [R1608-0603]
SB4  (no value)  [SOLDER-BRIDGE_R0603-0R]  (no BOM)
SB5  (no value)  [SOLDER-BRIDGE_R0603-0R]  (no BOM)

### Ports
5V (in), ENC_A (out), ENC_B (out), GND

### Nets
GND: C16.1 C17.1 C18.1 C19.1 D18.1(K) D20.1(K) D21.1(K) D23.1(K) IC4.3(DI) IC4.4(GND) IC5.3(DI) IC5.4(GND) P8.5 P8.6 ; port GND
5V: C16.2 C17.2 C18.2 C19.2 FU2.2 IC4.1(Vcc) IC5.1(Vcc) ; port 5V
A+: F12.1 P8.1
A-: F13.1 P8.2
B+: F14.1 P8.3
B-: F15.1 P8.4
ENC_A: IC4.2(RO) ; port ENC_A
ENC_B: IC5.2(RO) ; port ENC_B
NetD18_2: D18.2(A) D19.2(A) F12.0 IC4.8(A) R14.2
NetD19_1: D19.1(K) D20.2(A) F13.0 IC4.7(B) SB4.1
NetD21_2: D21.2(A) D22.2(A) F14.0 IC5.8(A) R15.2
NetD22_1: D22.1(K) D23.2(A) F15.0 IC5.7(B) SB5.1
NetFU2_1: FU2.1 P8.7 P8.8
NetR14_1: R14.1 SB4.2
NetR15_1: R15.1 SB5.2

Not connected (* = marked no-connect by the designer): IC4 5(Y) 6(Z); IC5 5(Y) 6(Z)

### Channels
1: designators end in _1; ports 5V=+5 ENC_A=az_enc_A ENC_B=az_enc_B GND=GND
2: designators end in _2; ports 5V=+5 ENC_A=el_enc_A ENC_B=el_enc_B GND=GND

### Library data of the parts
C16-C19 = Cap: as C3 on sheet abs_enc_driver; Тип элемента: Керамический конденсатор
  C16 C18: Номинал: 4.7uF
  C17 C19: Номинал: 0.1uF
D18-D23 = SMBJ_CА: as D5 on sheet abs_enc_driver; Название: SMBJ5.0CA; Артикул: SMBJ5.0CA; ComponentLink: http://www.digikey.com/product-detail/en/SMBJ5.0CA/SMBJ5.0CABTR-ND/2254207
F12-F15 = TBU-CA: as F4 on sheet abs_enc_driver; Название: TBU-CA065-200-WH; Артикул: TBU-CA065-200-WH; Тип элемента: Самовосстанавливающийся предохранитель
FU2 = MF-MSMF030: as FU1 on sheet abs_enc_driver; Название: MF-MSMF030; Артикул: MF-MSMF030
IC4 IC5 = ADM4857: as IC2 on sheet abs_enc_driver; Артикул: ADM4857arz; Название: ADM4857arz
P8 = BH-08: Разъем штыревой на плату; Производитель: Connfly electronic (Zhenqin); Номинал: 1А; Напряжение: 300В; Вид монтажа: DIP; Температурный диапазон: -55…140; Примечание: шаг 2.54 мм; Название: BH-08; Артикул: BH-08; Тип элемента: Разъем
R14 R15 = resistor: as R1 on sheet Power; Номинал: 120R; Точность: 1%; Название: Резистор; Вид монтажа: SMD; Тип элемента: Резистор
SB4 SB5 = SB: Перемычка

## Sheet Brake.SchDoc
size A4; SheetNumber: 6; SheetTotal: 8
Used 2 times, as channels 1, 2. Parts and nets are listed once, with the designators drawn on the sheet.
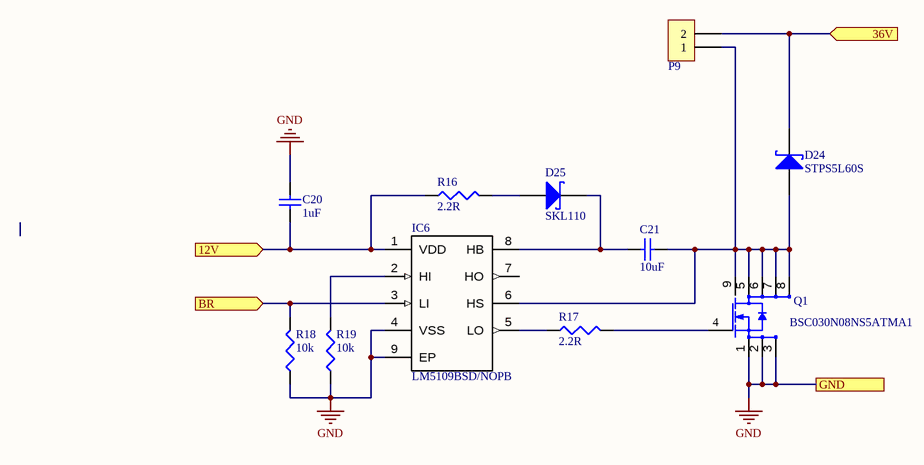
[diagram p7: Brake.SchDoc]

### Parts
C20  1uF  [C1608-0603]
C21  10uF  [C1608-0603]
D24  STPS5L60S  [SMCJ]
D25  SKL110  [SODFL370X140-2N]
IC6  LM5109BSD/NOPB  [PSON80P400X80_HS-9N]
P9  15EDGRC-3.81-02  [15EDGRC-3.81-02]  (value not drawn)
Q1  BSC030N08NS5ATMA1  [PG-TDSON-8]
R16  2.2R  [R1608-0603]
R17  2.2R  [R1608-0603]
R18  10k  [R1608-0603]
R19  10k  [R1608-0603]

### Ports
12V (in), 36V (in), BR (in), GND

### Nets
GND: C20.2 IC6.4(VSS) IC6.9(EP) Q1.1(S) Q1.2(S) Q1.3(S) R18.1 R19.1 ; port GND
12V: C20.1 IC6.1(VDD) R16.1 ; port 12V
36V: D24.1(K) P9.2 ; port 36V
BR: IC6.3(LI) R18.2 ; port BR
NetC21_1: C21.1 D25.1(K) IC6.8(HB)
NetC21_2: C21.2 D24.2(A) IC6.6(HS) P9.1 Q1.5(D) Q1.6(D) Q1.7(D) Q1.8(D) Q1.9(D)
NetD25_2: D25.2(A) R16.2
NetIC6_2: IC6.2(HI) R19.2
NetIC6_5: IC6.5(LO) R17.1
NetQ1_4: Q1.4(G) R17.2

Not connected (* = marked no-connect by the designer): IC6 7(HO)

### Channels
1: designators end in _1; ports 12V=+12 36V=36V_AZ BR=az_br GND=GND
2: designators end in _2; ports 12V=+12 36V=36V_EL BR=el_br GND=GND

### Library data of the parts
C20 C21 = Cap: as C3 on sheet abs_enc_driver; Тип элемента: Керамический конденсатор
  C20: Номинал: 1uF
  C21: Номинал: 10uF
D24 = STPS5L60S: as D1 on sheet Power; Название: STPS5L60S; Артикул: STPS5L60S; Напряжение: 60В; Тип элемента: Диод шоттки
D25 = SKL110: Диод Шоттки 100В 1А; Производитель: STMicroelectronics; Корпус: do-214ab/smc; Вид монтажа: SMD; Название: SKL110; Артикул: SKL110; Напряжение: 100В; Тип элемента: Диод шоттки
IC6 = LM5109BSD/NOPB: Драйвер MOSFET; Номинал: 108V/1A; Вид монтажа: SMD; Тип элемента: Микросхема; Температурный диапазон: -40 to +125 °C; Название: LM5109BSD/NOPB; Артикул: LM5109BSD/NOPB
P9 = 15EDGRC-3.81-02: as P5 on sheet Power; Название: 15EDGRC-3.81-02; Артикул: 15EDGRC-3.81-02; Тип элемента: Разъем
Q1 = BSC030N08NS5ATMA1: N - канальный MOSFET; Номинал: 80V/100A; Вид монтажа: SMD; Тип элемента: Полевой транзистор; Температурный диапазон: -40 to +125 °C; Название: BSC030N08NS5ATMA1; Артикул: BSC030N08NS5ATMA1
R16-R19 = resistor: as R1 on sheet Power; Точность: 1%; Название: Резистор; Вид монтажа: SMD; Тип элемента: Резистор
  R16 R17: Номинал: 2.2R
  R18 R19: Номинал: 10k

## Nets that join several sheets
3V3: STM_board (P10.5), 1 (7 pins), 2 (7 pins)
36V_AZ: Power (D2.1 F1.2 P2.2 R1.2), 1 (D24_1.1 P9_1.2)
36V_EL: Power (D1.1 F2.2 P4.2 R2.2), 2 (D24_2.1 P9_2.2)
+5: Power (C2.1 R5.2 U1.3), STM_board (P10.7), 1 (5 pins), 1 (10 pins), 1 (7 pins), 2 (5 pins), 2 (7 pins), 2 (10 pins)
+12: Power (6 pins), 1 (C20_1.1 IC6_1.1 R16_1.1), 2 (C20_2.1 IC6_2.1 R16_2.1)
+VM: 1 (P15_1.1 P16_1.1), 2 (P15_2.1 P16_2.1)
GND: Power (16 pins), STM_board (9 pins), 1 (15 pins), 1 (17 pins), 1 (7 pins), 1 (14 pins), 1 (8 pins), 2 (15 pins), 2 (14 pins), 2 (8 pins), 2 (17 pins), 2 (7 pins)
GND_line: 1 (11 pins), 2 (11 pins)
az_br: 1 (P18_1.1), 1 (IC6_1.3 R18_1.2)
az_enc_A: 1 (P17_1.3), 1 (IC4_1.2)
az_enc_B: 1 (P17_1.2), 1 (IC5_1.2)
az_sai_fs: STM_board (P13.16), 1 (IC1_1.3)
az_sai_sck: debug_board (P1.3 P1.7), STM_board (P13.18)
az_sai_sck_dr: debug_board (P1.2 P1.4), 1 (IC1_1.4)
az_sai_sd: STM_board (P13.20), 1 (IC2_1.2)
az_spi_cs: STM_board (P11.17), 1 (P14_1.30)
az_spi_en: STM_board (P10.14), 1 (P14_1.8)
az_spi_miso: STM_board (P10.8), 1 (P14_1.33)
az_spi_mosi: STM_board (P10.10), 1 (P14_1.32)
az_spi_sck: STM_board (P10.6), 1 (P14_1.31)
ccw_button_az: STM_board (P13.2), 1 (C3_1.2 D11_1.2 R10_1.2 R11_1.1)
ccw_button_el: STM_board (P13.8), 2 (C3_2.2 D11_2.2 R10_2.2 R11_2.1)
el_br: 2 (P18_2.1), 2 (IC6_2.3 R18_2.2)
el_enc_A: 2 (P17_2.3), 2 (IC4_2.2)
el_enc_B: 2 (P17_2.2), 2 (IC5_2.2)
el_sai_fs: STM_board (P13.28), 2 (IC1_2.3)
el_sai_sck: debug_board (P1.1 P1.5), STM_board (P13.24)
el_sai_sck_dr: debug_board (P1.6 P1.8), 2 (IC1_2.4)
el_sai_sd: STM_board (P13.22), 2 (IC2_2.2)
el_spi_cs: STM_board (P11.9), 2 (P14_2.30)
el_spi_en: STM_board (P10.16), 2 (P14_2.8)
el_spi_miso: STM_board (P11.12), 2 (P14_2.33)
el_spi_mosi: STM_board (P11.13), 2 (P14_2.32)
el_spi_sck: STM_board (P11.10), 2 (P14_2.31)
PD0: STM_board (P13.25), 2 (IC3_2.3)
PD1: STM_board (P13.27), 2 (IC3_2.6)
PD5: STM_board (P13.6), 1 (IC3_1.6)
PD6: STM_board (P13.4), 1 (IC3_1.3)